# Altium schematic sheet OTP6_PingCircuit.SchDoc
size Legal
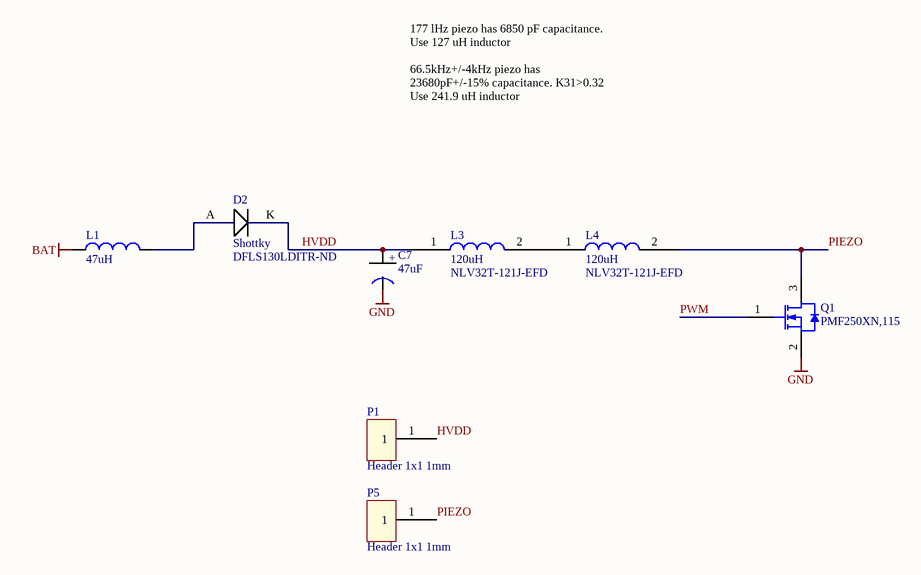
[diagram p0: OTP6_PingCircuit.SchDoc]

## Parts
C7  47uF  [Tant0805]
D2  Shottky  Supplier Part Number 1: DFLS130LDITR-ND  [DFLS130]
L1  47uH  [Inductor KLZ1608AHR]
L3  120uH  Supplier Part Number 1: NLV32T-121J-EFD  [Inductor_NLV32T]
L4  120uH  Supplier Part Number 1: NLV32T-121J-EFD  [Inductor_NLV32T]
P1  Header 1x1 1mm  [Header1x1mm]
P5  Header 1x1 1mm  [Header1x1mm]
Q1  PMF250XN,115  [NXP-SOT323_N]

## Nets
BAT: L1.1
GND: C7.1(GND) Q1.2(S)
HVDD: C7.2(+) D2.K L3.1 P1.1
PIEZO: L4.2 P5.1 Q1.3(D)
PWM: Q1.1(G)
NetD2_A: D2.A L1.2
NetL3_2: L3.2 L4.1

## Notes on the sheet
- 177 lHz piezo has 6850 pF capacitance.
  Use 127 uH inductor
  66.5kHz+/-4kHz piezo has 23680pF+/-15% capacitance. K31>0.32
  Use 241.9 uH inductor

## Library data of the parts
C7 = Tant0805: Value: 10uF
D2 = DFLS130: Supplier 1: Digi-Key
L1 = Inductor KLZ1608: Supplier 1: Mouser; Supplier Part Number 1: 810-KLZ1608AHR2R2WTD
L3 L4 = Inductor_NLV32T: Supplier 1: Mouser
P1 P5 = Header 1x1 1mm: 1mm through hole
Q1 = PMF250XN,115: N-Channel Trench MOSFET, 30 V, 0.9 A, -55 to 150 degC, 3-Pin SOT323, Tape and Reel; Manufacturer: NXP Semiconductors; Channel Type: N; Ciss [typ] (pF): 50; Coss [typ] (pF): 10; ID [max] (A): 0.9; Packing: Tape & Reel; VDS [max] (V): 30; VGSth [typ] (V): 1; DatasheetVersion: Rev. 1; PackageVersion: 06-03-16, 03/2006; PackageReference: SOT323; PackageDescription: 3-Pin Small Outline Transistor Package, Body 2 x 1.25 mm, Pitch 0.65 mm; Supplier 1: Digi-Key; Supplier Part Number 1: 568-10784-2-ND; Supplier 2: Digi-Key; Supplier Part Number 2: 568-10784-1-ND; Supplier 3: Digi-Key; Supplier Part Number 3: 568-10784-6-ND; Supplier 4: Mouser; Supplier Part Number 4: 771-PMF250XN,115; Mounting Technology: Surface Mount; Code_JEITA: SC-70; PartNumber: PMF250XN,115; ComponentLink1Description: Manufacturer URL; ComponentLink1URL: http://www.nxp.com/; ComponentLink2Description: Datasheet; ComponentLink2URL: http://www.nxp.com/documents/data_sheet/PMF250XN.pdf; ComponentLink3Description: Package Specification; ComponentLink3URL: http://www.nxp.com/documents/outline_drawing/sot323_po.pdf